# EAGLE design Audio Amplifier(bass boost) (EAGLE 9.6.1)
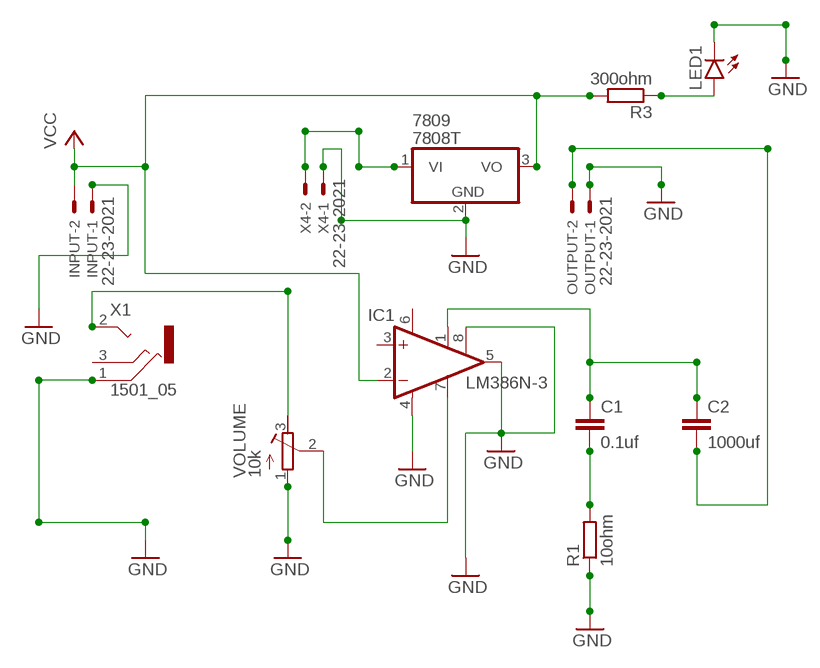
[diagram p0: schematic, sheet 1]

## Parts
7809  7808T  [TO220H]
C1  0.1uf  C2.5/2  [C2.5-2]
C2  1000uf  C5/3  [C5B3]
IC1  LM386N-3  [DIL08]
INPUT  22-23-2021  [22-23-2021]
LED1  LED5MM  [LED5MM]
OUTPUT  22-23-2021  [22-23-2021]
R1  10ohm  R-EU_0207/7  [0207/7]
R3  300ohm  R-EU_0207/7  [0207/7]
VOLUME  10k  R-TRIMM64W  [RTRIM64W]
X1  1501_05  [1501_05]
X4  22-23-2021  [22-23-2021]

## Nets
GND [Ground]: 7809.2(GND) IC1.4(GND) IC1.5(OUT) IC1.8(GAIN) INPUT.1 LED1.K(C) OUTPUT.1 R1.1 VOLUME.1(A) X1.1 X4.1
N$1 [Ground]: VOLUME.3(E) X1.2
N$2: IC1.7(BYPASS) VOLUME.2(S)
N$3 [Ground]: C1.1 C2.1 IC1.1(GAIN)
N$4 [Ground]: C1.2 R1.2
N$5 [Ground]: C2.2 OUTPUT.2
N$6 [Ground]: 7809.1(VI) X4.2
N$7: LED1.A R3.1
VCC [Ground]: 7809.3(VO) IC1.2(-IN) INPUT.2 R3.2
Unconnected: IC1.3(+IN) X1.3

## Power pins joined to a net without a drawn wire
VS: IC1.6(VS)

## Library data of the parts
7809 = linear:78*: Positive VOLTAGE REGULATOR Source: http://cache.national.com/ds/LM/LM78L05.pdf http://www.fairchildsemi.com/ds/LM/LM7805.pdf
C1 C2 = capacitor-wima:C: CAPACITOR naming: grid - package width
IC1 = linear:LM386?-*: Low Voltage Audio Power Amplifier Source: http://cache.national.com/ds/LM/LM386.pdf
INPUT OUTPUT X4 = con-molex:22-23-2021: .100" (2.54mm) Center Header - 2 Pin; MF: MOLEX; MPN: 22-23-2021; OC_FARNELL: 1462926; OC_NEWARK: 25C3832
LED1 = led:LED: LED OSRAM: - CHIPLED LG R971, LG N971, LY N971, LG Q971, LY Q971, LO R971, LY R971 LH N974, LH R974 LS Q976, LO Q976, LY Q976 LO Q996 - Hyper CHIPLED LW Q18S LB Q993, LB Q99A, LB R99A - SideLED LS A670, LO A670, LY A670, LG A670, LP A670 LB A673, LV A673, LT A673, LW A673 LH A674 LY A675 LS A676, LA A676, LO A676, LY A676, LW A676 LS A679, LY A679, LG A679 - Hyper Micro SIDELED® LS Y876, LA Y876, LO Y876, LY Y876 LT Y87S - SmartLED LW L88C, LW L88S LB L89C, LB L89S, LG L890 LS L89K, LO L89K, LY L89K LS L896, LA L896, LO L896, LY L896 - TOPLED LS T670, LO T670, LY T670, LG T670, LP T670 LSG T670, LSP T670, LSY T670, LOP T670, LYG T670 LG T671, LOG T671, LSG T671 LB T673, LV T673, LT T673, LW T673 LH T674 LS T676, LA T676, LO T676, LY T676, LB T676, LH T676, LSB T676, LW T676 LB T67C, LV T67C, LT T67C, LS T67K, LO T67K, LY T67K, LW E67C LS E67B, LA E67B, LO E67B, LY E67B, LB E67C, LV E67C, LT E67C LW T67C LS T679, LY T679, LG T679 LS T770, LO T770, LY T770, LG T770, LP T770 LB T773, LV T773, LT T773, LW T773 LH T774 LS E675, LA E675, LY E675, LS T675 LS T776, LA T776, LO T776, LY T776, LB T776 LHGB T686 LT T68C, LB T68C - Hyper Mini TOPLED® LB M676 - Mini TOPLED Santana® LG M470 LS M47K, LO M47K, LY M47K Source: http://www.osram.convergy.de LUXEON: - LUMILED® LXK2-PW12-R00, LXK2-PW12-S00, LXK2-PW14-U00, LXK2-PW14-V00 LXK2-PM12-R00, LXK2-PM12-S00, LXK2-PM14-U00 LXK2-PE12-Q00, LXK2-PE12-R00, LXK2-PE12-S00, LXK2-PE14-T00, LXK2-PE14-U00 LXK2-PB12-K00, LXK2-PB12-L00, LXK2-PB12-M00, LXK2-PB14-N00, LXK2-PB14-P00, LXK2-PB14-Q00 LXK2-PR12-L00, LXK2-PR12-M00, LXK2-PR14-Q00, LXK2-PR14-R00 LXK2-PD12-Q00, LXK2-PD12-R00, LXK2-PD12-S00 LXK2-PH12-R00, LXK2-PH12-S00 LXK2-PL12-P00, LXK2-PL12-Q00, LXK2-PL12-R00 Source: www.luxeon.com KINGBRIGHT: KA-3528ASYC Source: www.kingbright.com
R1 R3 = rcl:R-EU_: RESISTOR, European symbol; SPICEPREFIX: R
VOLUME = rcl:R-TRIMM: Trimm resistor; SPICEMODEL: X; SPICEPREFIXL: POT
X1 = con-lumberg:1501_0*: Jack connectors according to JISC 6560, 2.5 mm Klinkensteckverbinder nach JISC 6560, 2,5 mm Source: http://www.lumberg.com/Produkte/PDFs/1501_05.pdfedit 1501_03 http://www.lumberg.com/Produkte/PDFs/1501_06.pdf; OC_FARNELL: 1216978; OC_NEWARK: unknown

## Net classes
0 default: width 0.406 mm
1 Ground: width 0.61 mm

## Board
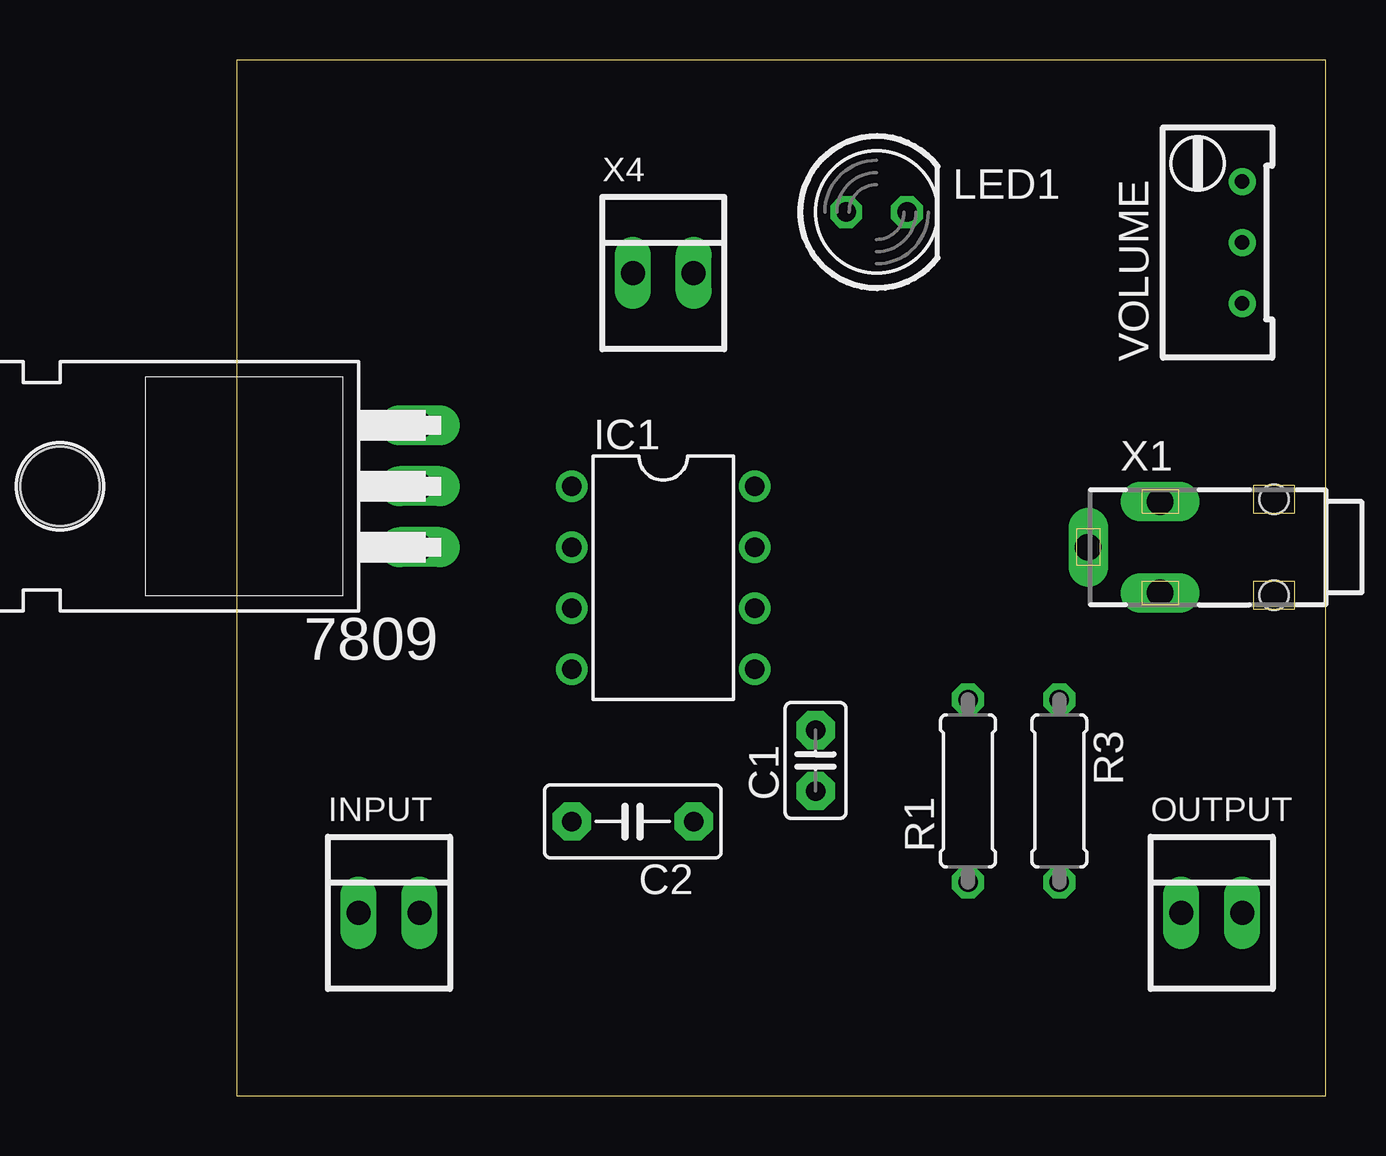
[diagram p1: board, top side]
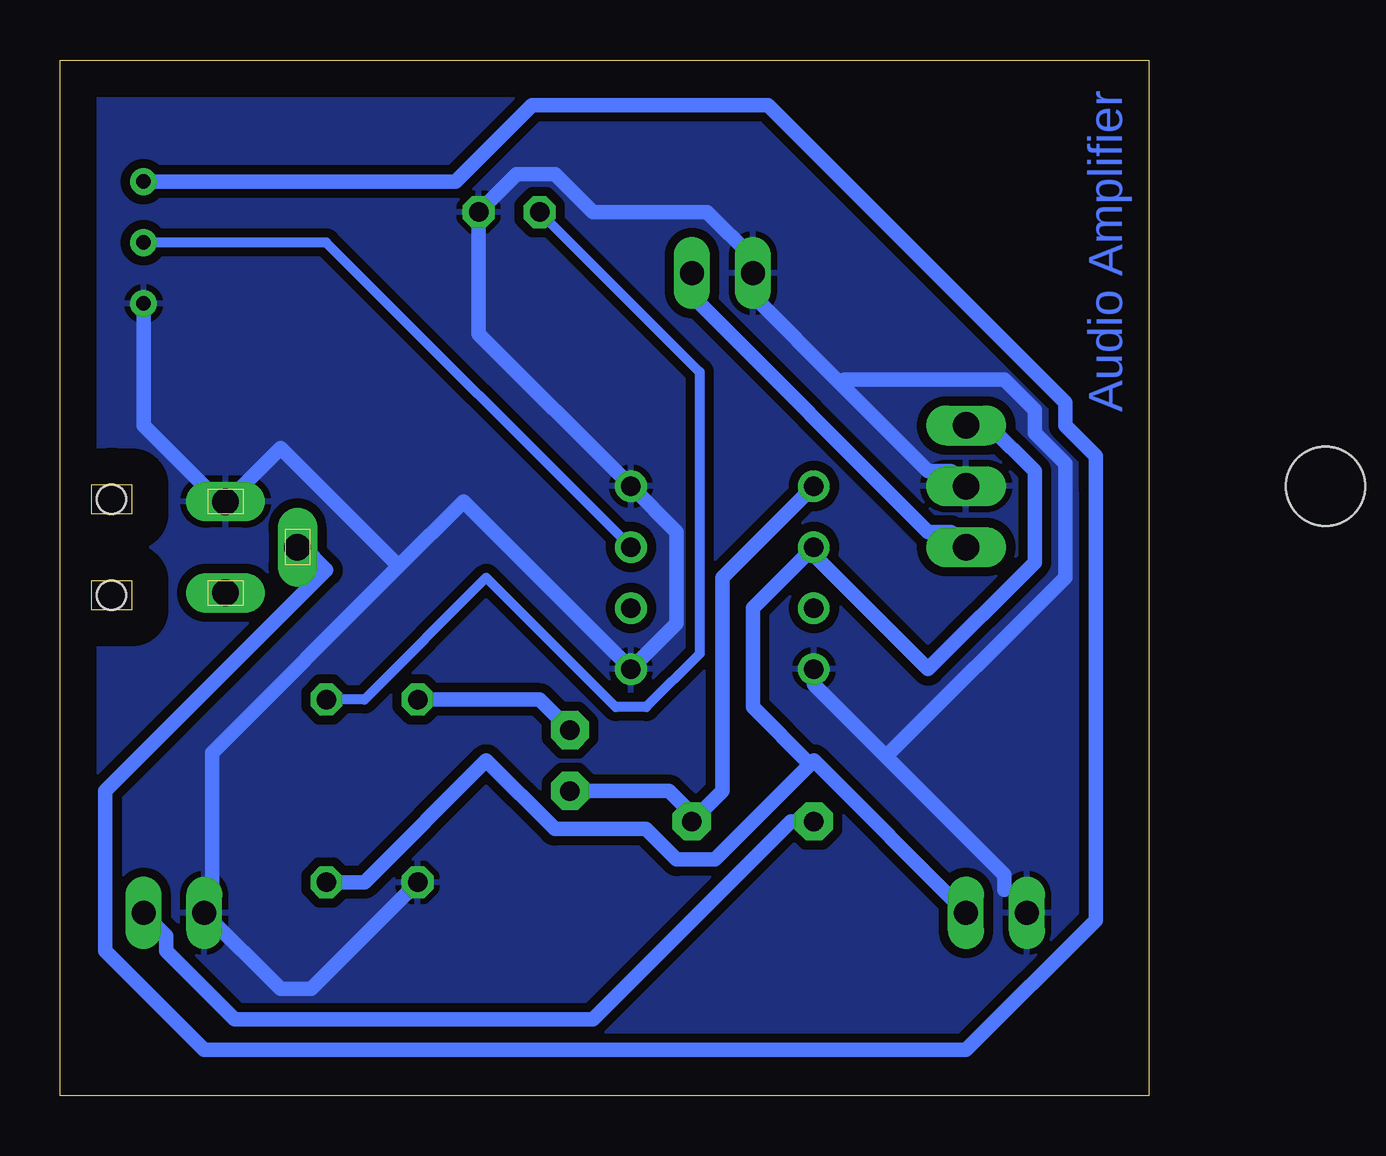
[diagram p2: board, bottom side, seen from below]

Size 45.39 x 43.17 mm. Coordinates in mm from the lower left corner, seen from the top.
Outline: 0,0 45.39,0 45.39,43.17 0,43.17 0,0
Copper layers (1*16): Top 0.035mm / dielectric 1.5mm / Bottom 0.035mm
Design rules "default *": minimum track width 15mil, minimum drill 0.35mm, track to track 15mil, track to pad 15mil, pad to pad 15mil, via to via 6mil, smd to smd 6mil, copper to edge 60mil, drill to drill 15mil, minimum pad ring 10mil, minimum via ring 8mil, stop-mask expansion 4mil, vias tented up to drill 0mil, thermal gap 10mil

### Footprints (pad centres in the part's own frame; a part is rotated, then mirrored left to right if it is on the bottom)
TO220H = drill 1.118 long: 1 -2.54,-10.16; 2 0,-10.16; 3 2.54,-10.16 | hole 3.302: 0,4.826
C2.5-2 = drill 0.813 pad 1.6 octagon: 1 -1.27,0; 2 1.27,0
C5B3 = drill 0.813 pad 1.6 octagon: 1 -2.54,0; 2 2.54,0
DIL08 = drill 0.813 pad 1.27: 1 -3.81,-3.81; 2 -1.27,-3.81; 3 1.27,-3.81; 4 3.81,-3.81; 5 3.81,3.81; 6 1.27,3.81; 7 -1.27,3.81; 8 -3.81,3.81
22-23-2021 = drill 1 long: 1 -1.27,0; 2 1.27,0
LED5MM = drill 0.813 octagon: A -1.27,0; K 1.27,0
0207/7 = drill 0.813 octagon: 1 -3.81,0; 2 3.81,0
RTRIM64W = drill 0.61: 1 1.27,-2.54; 2 1.27,0; 3 1.27,2.54
1501_05 = drill 1.1 pad 1.4 long: 1 -1.9,-8.5; 2 0,-11.5; 3 1.9,-8.5 | hole 1.2: -2,-3.75; 2,-3.75

### Placement (x,y rotation side)
7809  -2.54,25.4 90 top
C1  24.13,13.97 90 top
C2  16.51,11.43 180 top
IC1  17.78,21.59 270 top
INPUT  6.35,7.62 0 top
LED1  26.67,36.83 0 top
OUTPUT  40.64,7.62 0 top
R1  30.48,12.7 90 top
R3  34.29,12.7 270 top
VOLUME  40.64,35.56 0 top
X1  46.99,22.86 270 top
X4  17.78,34.29 0 top

### Tracks (layer width: path | path; a pad name or v marks a point on that pad's centre or on a via)
GND
  Bottom 0.61: 10.95,14.13 6.03,9.21 6.03,8.57 | 10.95,14.13 13.97,17.14 | 12.86,29.69 9.21,26.04 8.26,26.04 7809.2 | 12.86,29.69 16.51,33.34 X4.1 16.51,34.92 18.41,36.83 23.18,36.83 24.77,38.42 26.35,38.42 LED1.K 27.94,31.75 IC1.8 19.68,23.5 19.68,19.68 IC1.5 28.57,24.77 31.27,22.07 | VOLUME.1 41.91,27.94 38.73,24.77 X1.1 38.42,24.77 36.2,26.99 31.27,22.07 | R1.1 34.92,4.45 36.2,4.45 OUTPUT.1 39.05,7.62 39.05,14.29 31.27,22.07 | 10.95,14.13 3.49,21.59 3.49,26.35 4.76,27.62 4.76,28.57 6.03,29.84 12.7,29.84 12.86,29.69
  pour Bottom: 0,43.18 45.72,43.18 45.72,0 0,0
N$1
  Bottom 0.61: VOLUME.3 28.89,38.1 25.72,41.27 15.88,41.27 3.49,28.89 3.49,27.94 2.22,26.67 2.22,7.3 7.62,1.91 39.37,1.91 43.5,6.03 43.5,12.7 34.29,21.91 35.24,22.86 X1.2
N$2
  Bottom 0.406: IC1.7 34.29,35.56 VOLUME.2
N$3
  Bottom 0.61: IC1.1 17.78,21.59 17.78,12.7 C2.1 19.05,11.75 20,12.7 C1.1
N$4
  Bottom 0.61: R1.2 25.4,16.51 C1.2
N$5
  Bottom 0.61: C2.2 14.92,11.43 23.18,3.17 38.1,3.17 40.96,6.03 40.96,6.67 OUTPUT.2
N$6
  Bottom 0.61: X4.2 19.05,33.34 9.21,23.5 8.26,23.5 7809.1
N$7
  Bottom 0.406: R3.1 32.7,16.51 27.62,21.59 22.23,16.19 20.95,16.19 18.73,18.41 18.73,30.16 LED1.A
VCC
  Bottom 0.61: R3.2 32.7,8.89 27.62,13.97 24.77,11.11 20.95,11.11 19.68,9.84 18.1,9.84 14.13,13.81 | 14.13,13.81 13.97,13.97 INPUT.2 | 14.13,13.81 16.51,16.19 16.51,20.32 IC1.2 13.97,22.54 9.21,17.78 4.76,22.23 4.76,26.04 6.67,27.94 7809.3

### Text on the board
Bottom: Audio Amplifier